# Altium schematic sheet hrng.SchDoc
size A; SheetNumber: 2; SheetTotal: 3
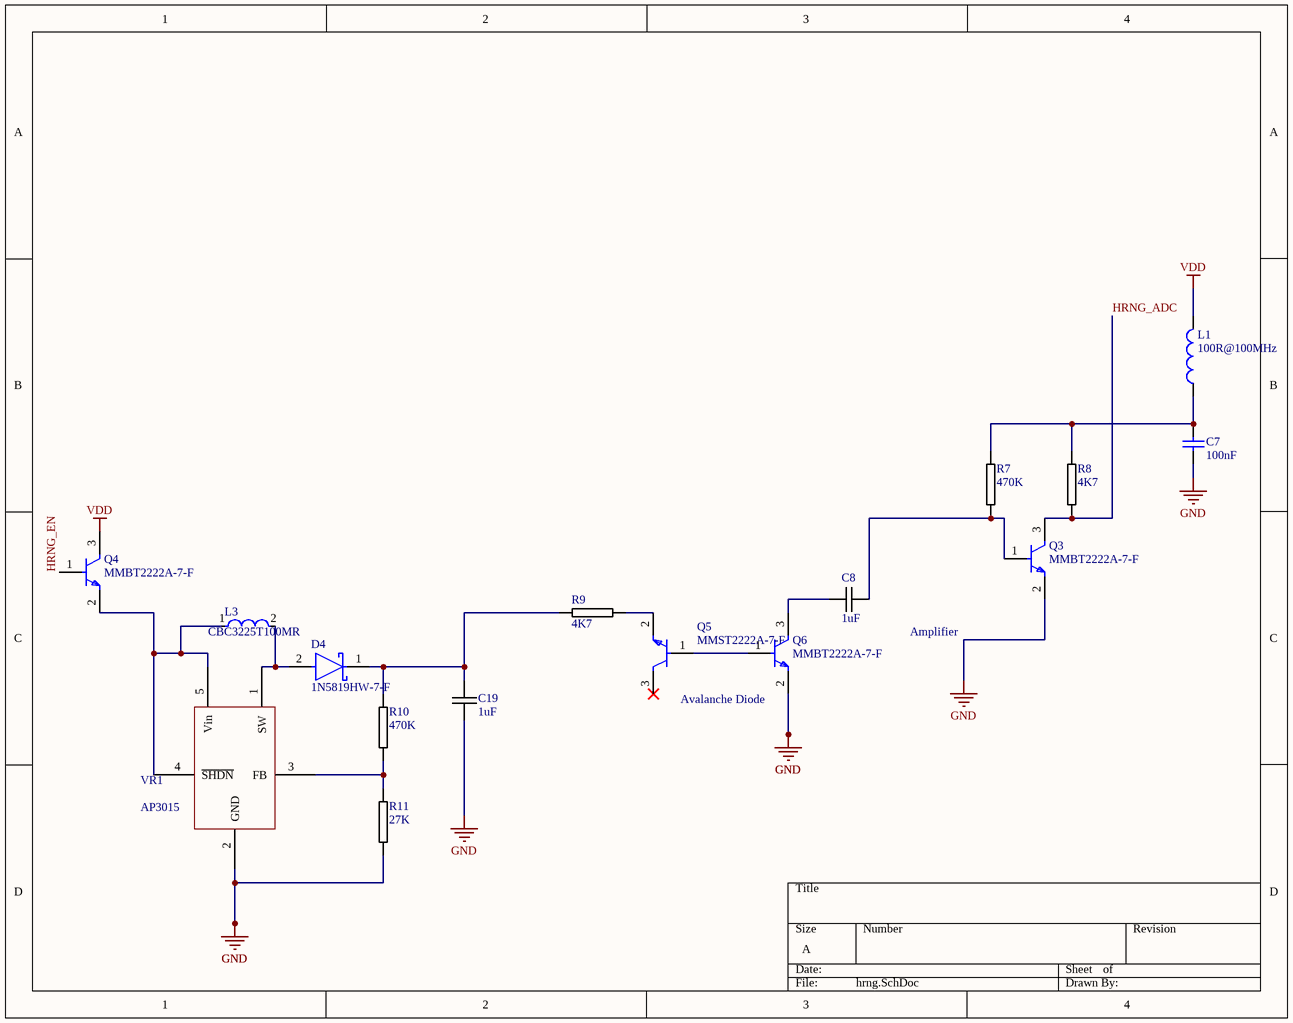
[diagram p0: hrng.SchDoc]

## Parts
C7  value 100nF  [C0402]  (hidden comment: Capacitor)
C8  1uF  [0402C-GENERIC]
C19  1uF  [0402C-GENERIC]
D4  1N5819HW-7-F  [FP-SOD123-IPC_A]
L1  value 100R@100MHz  [FIL_0603_H0P65]  (hidden comment: MCD-00094)
L3  CBC3225T100MR  [FP-CB3225-IPC_A]
Q3  MMBT2222A-7-F  [FP-SOT23-IPC_A]
Q4  MMBT2222A-7-F  [FP-SOT23-IPC_A]
Q5  MMST2222A-7-F  [FP-SOT23-IPC_A]
Q6  MMBT2222A-7-F  [FP-SOT23-IPC_A]
R7  470K  [0603R-470K]
R8  4K7  [0603R-4K7]
R9  4K7  [0603R-4K7]
R10  470K  [0603R-470K]
R11  27K  [0603R-27K]
VR1  AP3015  [SOT23-5]

## Nets
GND: C7.1 C19.2 Q3.2(E) Q6.2(E) R11.2 VR1.2(GND)
VDD: L1.2 Q4.3(C)
HRNG_ADC: Q3.3(C) R8.1
HRNG_EN: Q4.1(B)
NetC7_2: C7.2 L1.1 R7.1 R8.2
NetC8_1: C8.1 Q6.3(C)
NetC8_2: C8.2 Q3.1(B) R7.2
NetC19_1: C19.1 D4.1(C) R9.1 R10.1
NetD4_2: D4.2(A) L3.2 VR1.1(SW)
NetL3_1: L3.1 Q4.2(E) VR1.4(~{SHDN}) VR1.5(Vin)
NetQ5_1: Q5.1(B) Q6.1(B)
NetQ5_2: Q5.2(E) R9.2
NetR10_2: R10.2 R11.1 VR1.3(FB)

Not connected (* = marked no-connect by the designer): Q5 3(C)*

## Notes on the sheet
- Amplifier
- Avalanche Diode

## Library data of the parts
C7 = MCD-00102: Capacitor, MLCC, 100nF, 16V, X7R, 10%, 0402, T=0,5mm; Manufacturer_Part_Number: CC0402KRX7R7BB104; Manufacturer: YAGEO; Alternate_Manufacturer: MURATA; Alternate_Manufacturer_Part_Number: GCM155R71C104KA55D; Provided_By: SUBCO; Initial_Board_Reference: MB1262; Internal_Part_Number: MCD-00102; ComponentLink1Description: Datasheet; Status: Released; Part_Type: Capacitor; Package: C0402; ECCN_US: n/a; ECCN_EU: n/a; ComponentLink1URL: http://tunmcdsvn.tun.st.com/Component_Datasheet_Library/Trunk/Capacitors/Yageo_Multilayer_Capacitor_X7R_series_100pF_to_22uF
C8 C19 = 0402C-1UF-25V-X5R-SAM: CAPACITOR 0402 CERAMIC; Reel: C49
D4 = CMP-0303-00003-3: DIODE SCHOTTKY 40V 1A SOD123; Forward Voltage: 450mV; Capacitance: 110pF; Max Forward Surge Current (Ifsm): 25A; Peak Reverse Current: 50uA; Polarity: Standard; Element Configuration: Single; Max Power Dissipation: 450mW; Min Operating Temperature: -65°C; Package Quantity: 3000; Contact Plating: Tin; Weight: 0.000353oz; Max Repetitive Reverse Voltage (Vrrm): 40V; Max Reverse Voltage (DC): 40V; Height: 1.25mm; Average Rectified Current: 1A; Width: 1.7mm; Case/Package: SOD-123-2; Lead Free: Lead Free; Max Operating Temperature: 125°C; Current Rating: 1A; Termination: SMD/SMT; Forward Current: 1A; Radiation Hardening: No; Number of Pins: 2; Length: 2.85mm; Voltage Rating (DC): 40V; REACH SVHC: No SVHC; Peak Non-Repetitive Surge Current: 25A; Packaging: Tape and Reel; Output Current: 1A
L1 = MCD-00094: Ferrite bead 100R 2A 0603; Manufacturer_Part_Number: BLM18EG101TN1; Manufacturer: MURATA; Part_Type: Inductor; ECCN_US: EAR99; ECCN_EU: NEC; Provided_By: SUBCO; Initial_Board_Reference: mb1262; Internal_Part_Number: MCD-00094; ComponentLink1Description: Datasheet; Status: Released; ComponentLink1URL: http://tunmcdsvn.tun.st.com/Component_Datasheet_Library/Trunk/Inductors/Murata_EMI_Filters_BLM
L3 = CMP-14484-000123-1: SMD Inductors 10uH ±20% 0.9A 0.1729Ω 1210; Shielding: Unshielded; DC Resistance (DCR): 172.9mR; Core Material: Ferrite; Self Resonant Frequency: 23MHz; Max DC Current: 900mA; Test Frequency: 100kHz; Package Quantity: 1000; Military Standard: Not; Inductance: 10uH; Height: 2.5mm; Case Code (Metric): 3225; Width: 0.098inch; Case Code (Imperial): 1210; Inductance Tolerance: 20%; Lead Free: Lead Free; Length: 3.4mm; Max Operating Temperature: 105°C; Resistor Type: Wirewound; Height - Seated (Max): 0.106inch; Series: CB; Packaging: Tape and Reel; Depth: 2.7mm; Number of Pins: 2; Radiation Hardening: No; Tolerance: 20%; Case/Package: 1210; Mount: Surface Mount; Saturation Current: 900mA; Min Operating Temperature: -40°C; DC Current: 900mA; Current Rating: 900mA; Halogen Free: Halogen Free; Termination: SMD/SMT
Q3-Q6 = CMP-1693-00003-4: TRANS NPN 40V 0.6A SMD SOT23-3; Number of Elements: 1; Frequency: 300MHz; Max Collector Current: 600mA; Collector Base Voltage (VCBO): 75V; Current: 1A; Element Configuration: Single; Power Dissipation: 350mW; hFE Min: 100; Collector Emitter Saturation Voltage: 1V; Max Power Dissipation: 300mW; Emitter Base Voltage (VEBO): 6V; Voltage: 40V; Collector Emitter Breakdown Voltage: 40V; Width: 1.4mm; Polarity: NPN; Termination: SMD/SMT; Max Operating Temperature: 150°C; Transition Frequency: 300MHz; Contact Plating: Tin; Mount: Surface Mount; Max Frequency: 300MHz; Case/Package: SOT-23; Gain Bandwidth Product: 300MHz; Lead Free: Lead Free; Collector Emitter Voltage (VCEO): 40V; Radiation Hardening: No; Voltage Rating (DC): 40V; Height: 1mm; Max Breakdown Voltage: 40V; Packaging: Tape and Reel; Length: 3.05mm; Min Operating Temperature: -55°C; Weight: 0.000282oz; Current Rating: 600mA; REACH SVHC: No SVHC; Package Quantity: 3000; Continuous Collector Current: 600mA; Number of Pins: 3
R7 R10 = 0603R-470K: GENERIC RESISTOR 0603; Manufacturer Part Number: RMCF 1/16 470K 1% R; Manufacturer: Stackpole Electronics Inc; Temperature Coefficient: ±100ppm/°C; Tolerance: ±1%; Power (Watts): 0.1W, 1/10W; Supplier 1: Digi-Key; Supplier Part Number 1: RMCF1/16470KFRCT-ND; Supplier Part Number: RMCF1/16470KFRCT-ND; Composition: Thick Film; Category: Resistors; Lead Style: Surface Mount (SMD - SMT); RoHS: RoHS Compliant; Resistance In Ohms: 470K; Case: 0603 (1608 metric); Supplier: Digi-Key; Packaging: Cut Tape (CT)
R8 R9 = 0603R-4K7: GENERIC RESISTOR 0603; Manufacturer: Stackpole Electronics Inc; Manufacturer Part Number: RMCF 1/16 4.7K 1% R; Reel: R23; Supplier 1: Digi-Key; Supplier Part Number 1: RMCF0603FT4K70TR-ND
R11 = 0603R-27K: GENERIC RESISTOR 0603; Manufacturer: Stackpole Electronics Inc; Manufacturer Part Number: RMC 1/16 27K 1% R; Resistance In Ohms: 27.0K; Temperature Coefficient: ±100ppm/°C; Tolerance: ±1%; Power (Watts): 0.1W, 1/10W; Supplier 1: Digi-Key; Supplier Part Number 1: RMC1/1627KFR-ND; Case: 0603 (1608 metric); Supplier: Digi-Key; Packaging: Tape & Reel (TR); RoHS: RoHS Compliant; Category: Resistors; Composition: Thick Film; Supplier Part Number: RMC1/1627KFR-ND; Lead Style: Surface Mount (SMD - SMT)
VR1 = LT1930A